# EAGLE schematic Light-Adapter SMD (EAGLE 9.5.2)
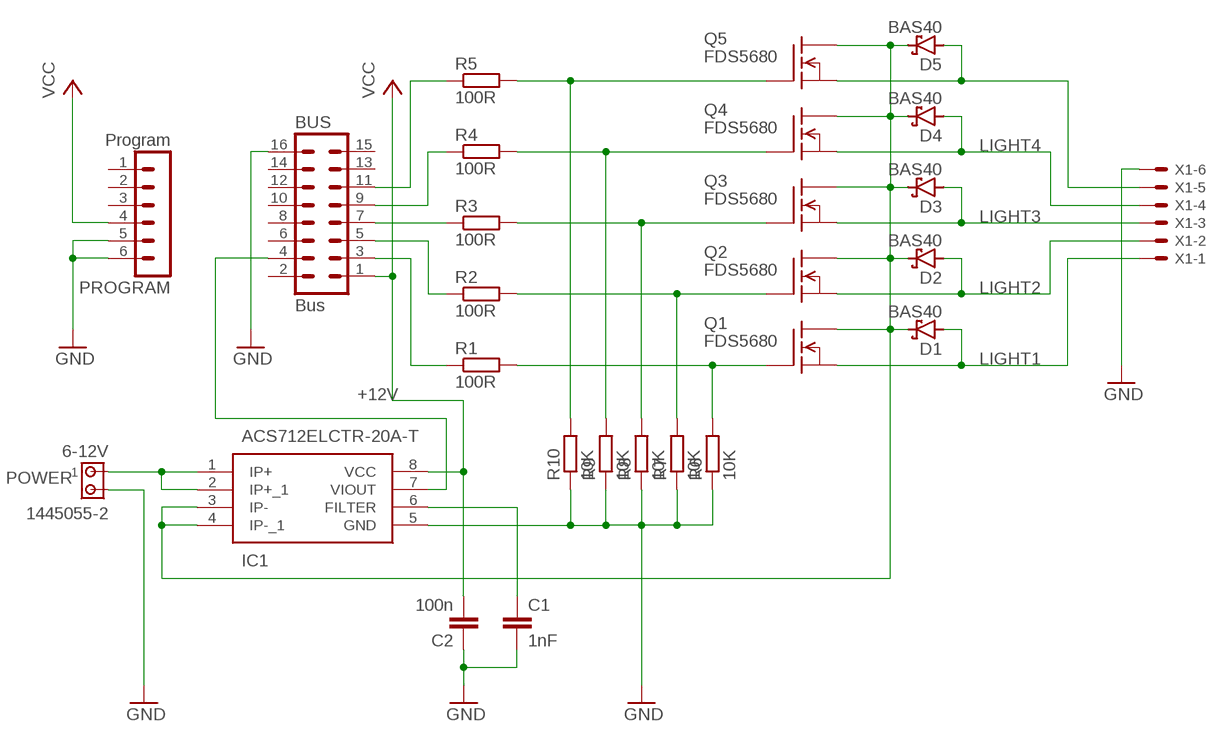
[diagram p0: schematic, sheet 1]

## Parts
6-12V  1445055-2  [1445055-2]
BUS  Bus  MA08-2  [MA08-2]
C1  1nF  C-EUC0402  [C0402]
C2  100n  C-EUC0402  [C0402]
D1  BAS40  [SOT23]
D2  BAS40  [SOT23]
D3  BAS40  [SOT23]
D4  BAS40  [SOT23]
D5  BAS40  [SOT23]
IC1  ACS712ELCTR-20A-T  [SOIC127P600X175-8N]
PROGRAM  Program  MA06-1  [MA06-1]
Q1  FDS5680  [SO-8]
Q2  FDS5680  [SO-8]
Q3  FDS5680  [SO-8]
Q4  FDS5680  [SO-8]
Q5  FDS5680  [SO-8]
R1  100R  R-EU_R0402  [R0402]
R2  100R  R-EU_R0402  [R0402]
R3  100R  R-EU_R0402  [R0402]
R4  100R  R-EU_R0402  [R0402]
R5  100R  R-EU_R0402  [R0402]
R6  10K  R-EU_R0402  [R0402]
R7  10K  R-EU_R0402  [R0402]
R8  10K  R-EU_R0402  [R0402]
R9  10K  R-EU_R0402  [R0402]
R10  10K  R-EU_R0402  [R0402]
X1  22-23-2061  [22-23-2061]

## Nets
+12V: D1.3(C) D2.3(C) D3.3(C) D4.3(C) D5.3(C) IC1.3(IP-) IC1.4(IP-_1) Q1.5(D) Q1.6(D) Q1.7(D) Q1.8(D) Q2.5(D) Q2.6(D) Q2.7(D) Q2.8(D) Q3.5(D) Q3.6(D) Q3.7(D) Q3.8(D) Q4.5(D) Q4.6(D) Q4.7(D) Q4.8(D) Q5.5(D) Q5.6(D) Q5.7(D) Q5.8(D)
GND: 6-12V.2 BUS.16 C1.2 C2.1 IC1.5(GND) PROGRAM.5 PROGRAM.6 R6.1 R7.1 R8.1 R9.1 R10.1 X1.6
LIGHT1: D1.1(A) Q1.1(S) Q1.2(S) Q1.3(S) X1.1
LIGHT2: D2.1(A) Q2.1(S) Q2.2(S) Q2.3(S) X1.2
LIGHT3: D3.1(A) Q3.1(S) Q3.2(S) Q3.3(S) X1.3
LIGHT4: D4.1(A) Q4.1(S) Q4.2(S) Q4.3(S) X1.4
LIGHT5: D5.1(A) Q5.1(S) Q5.2(S) Q5.3(S) X1.5
N$1: BUS.3 R1.1
N$2: BUS.5 R2.1
N$3: BUS.7 R3.1
N$5: BUS.9 R4.1
N$6: BUS.4 IC1.7(VIOUT)
N$7: C1.1 IC1.6(FILTER)
N$10: BUS.11 R5.1
N$11: Q5.4(G) R5.2 R10.2
N$13: Q4.4(G) R4.2 R9.2
N$14: Q3.4(G) R3.2 R8.2
N$15: Q2.4(G) R2.2 R7.2
N$16: Q1.4(G) R1.2 R6.2
POWER: 6-12V.1 IC1.1(IP+) IC1.2(IP+_1)
VCC: BUS.1 C2.2 IC1.8(VCC) PROGRAM.4
Unconnected: BUS.2 BUS.6 BUS.8 BUS.10 BUS.12 BUS.13 BUS.14 BUS.15 PROGRAM.1 PROGRAM.2 PROGRAM.3

## Library data of the parts
6-12V = con-amp:1445055-2: Micro MATE-N-LOK Connectors grid 1.5 mm Source: ENG_CD_1445055_A.pdf
BUS = con-lstb:MA08-2: PIN HEADER; OC_FARNELL: unknown; OC_NEWARK: unknown
C1 C2 = rcl:C-EU: CAPACITOR, European symbol; SPICEPREFIX: C
D1-D5 = diode:BAS40: Silicon Schottky Diodes General-purpose diode for high-speed switching
IC1 = SamacSys_Parts:ACS712ELCTR-20A-T: ACS712ELCTR-20A-T, Hall Effect Sensor 5V 8-Pin SOIC, SOIC N Source: Datasheet <http://uk.rs-online.com/web/p/products/6807135P>; ALLIED_NUMBER: R1076682; DESCRIPTION: ACS712ELCTR-20A-T, Hall Effect Sensor 5V 8-Pin SOIC, SOIC N; HEIGHT: 1.75mm; MANUFACTURER_NAME: Allegro Microsystems; MANUFACTURER_PART_NUMBER: ACS712ELCTR-20A-T; RS_PART_NUMBER: 6807135P; RS_PRICE-STOCK: http://uk.rs-online.com/web/p/products/6807135P
PROGRAM = con-lstb:MA06-1: PIN HEADER; OC_FARNELL: unknown; OC_NEWARK: unknown
Q1-Q5 = transistor-fet:FDS5680: 60V N-Channel PowerTrench TM MOSFET FAIRCHILD FDS5680.pdf
R1-R10 = rcl:R-EU_: RESISTOR, European symbol; SPICEPREFIX: R
X1 = con-molex:22-23-2061: .100" (2.54mm) Center Header - 6 Pin; MF: MOLEX; MPN: 22-23-2061; OC_FARNELL: 1462922; OC_NEWARK: 27C1933